# EAGLE design BacKey for MaKey MaKey (rev A) (EAGLE 6.4)

## Sheet 1 of 2
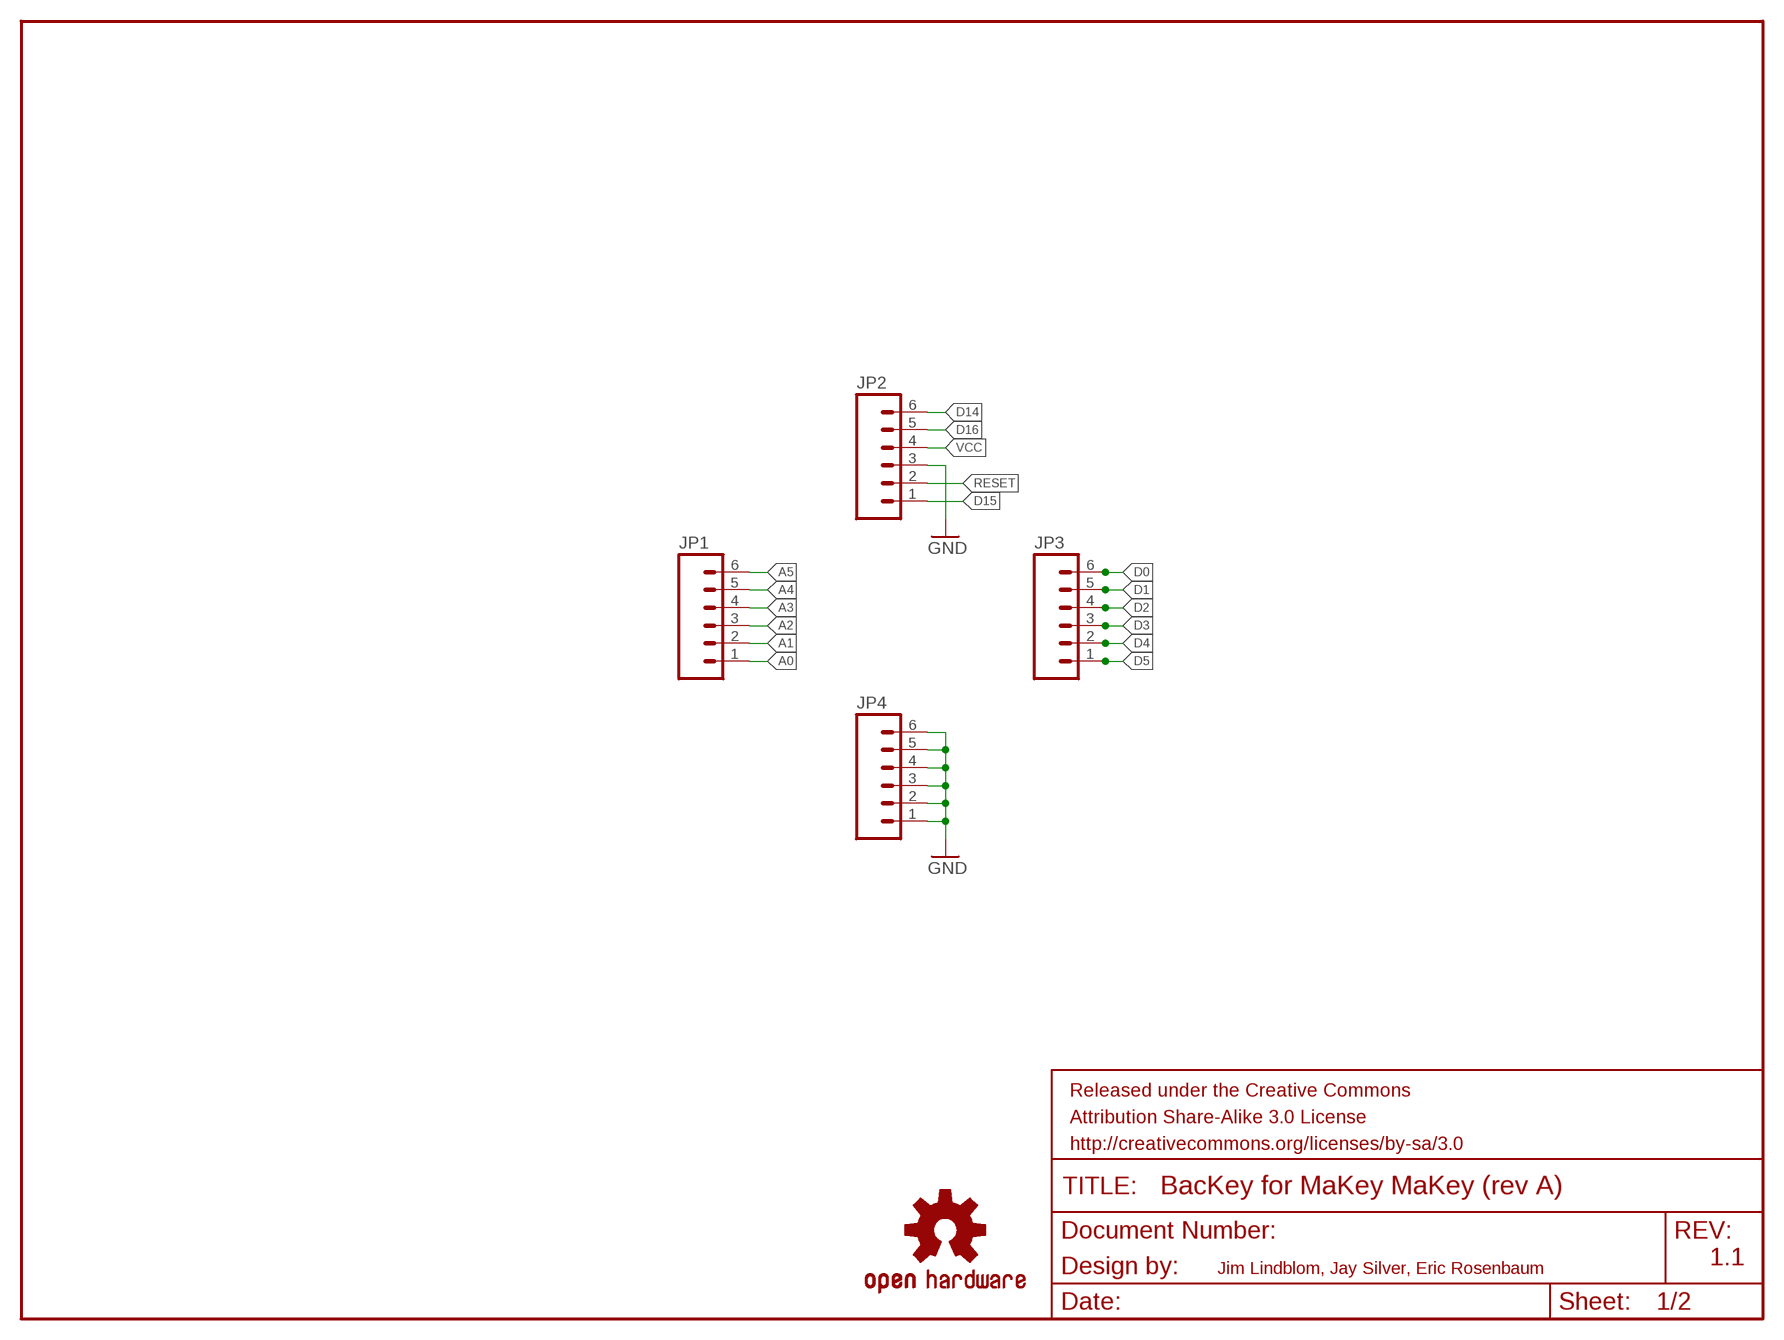
[diagram p0: schematic, sheet 1]

### Parts
JP1  M06SIP  [1X06]
JP2  M06SIP  [1X06]
JP3  M06SIP  [1X06]
JP4  M06SIP  [1X06]
U$1  OSHW-LOGOM  [OSHW-LOGO-M]

### Nets
A0: JP1.1
A1: JP1.2
A2: JP1.3
A3: JP1.4
A4: JP1.5
A5: JP1.6
D0: JP3.6
D1: JP3.5
D2: JP3.4
D3: JP3.3
D4: JP3.2
D5: JP3.1
D14: JP2.6
D15: JP2.1
D16: JP2.5
GND [vcc]: JP2.3 JP4.1 JP4.2 JP4.3 JP4.4 JP4.5 JP4.6
RESET: JP2.2
VCC: JP2.4

### Notes on the sheet
- 1.1
- Jim Lindblom, Jay Silver, Eric Rosenbaum

## Sheet 2 of 2
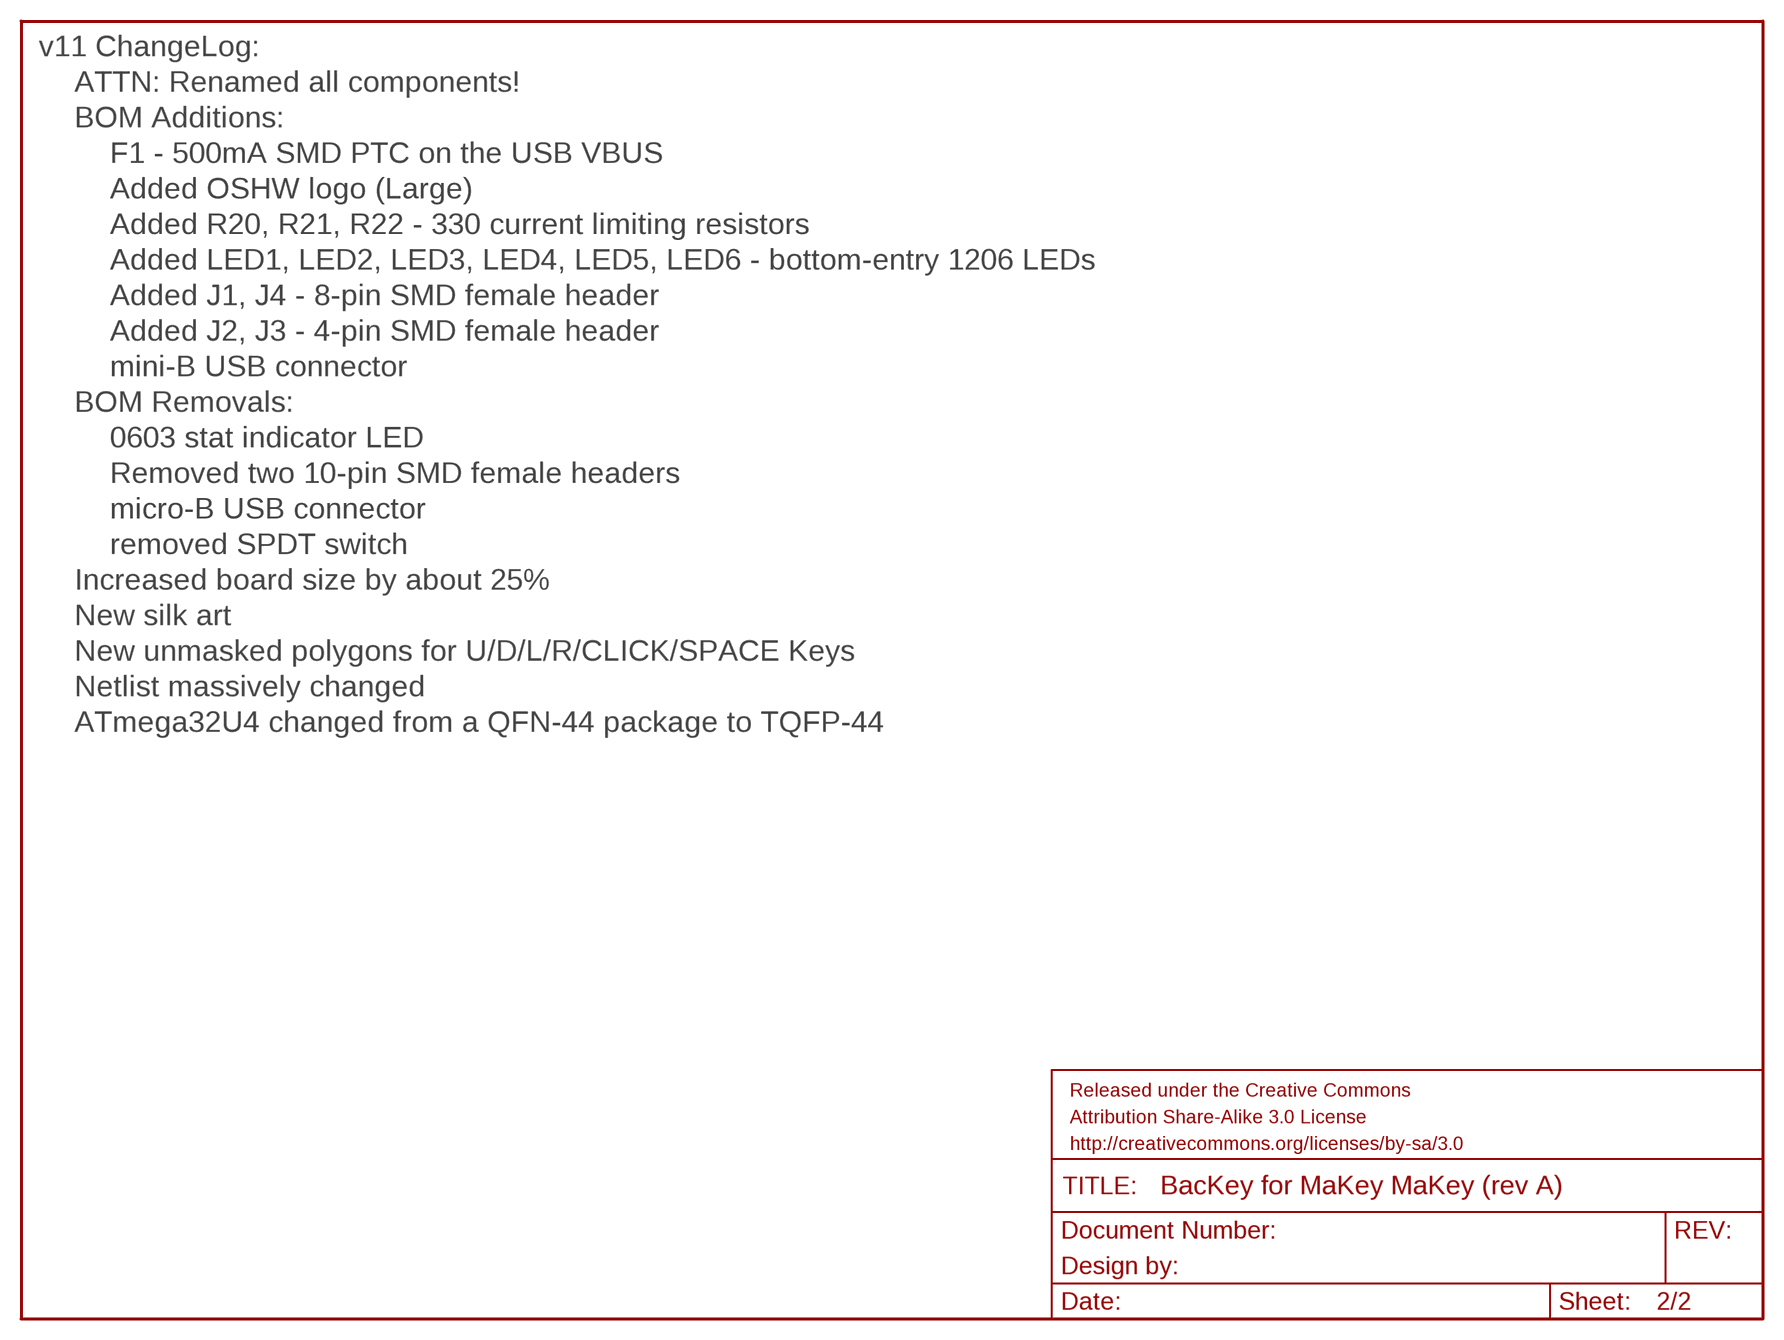
[diagram p1: schematic, sheet 2]

### Notes on the sheet
- v11 ChangeLog:
- ATTN: Renamed all components!
- BOM Additions:
- F1 - 500mA SMD PTC on the USB VBUS
- Added OSHW logo (Large)
- Added R20, R21, R22 - 330 current limiting resistors
- Added LED1, LED2, LED3, LED4, LED5, LED6 - bottom-entry 1206 LEDs
- Added J1, J4 - 8-pin SMD female header
- Added J2, J3 - 4-pin SMD female header
- mini-B USB connector
- BOM Removals:
- 0603 stat indicator LED
- Removed two 10-pin SMD female headers
- micro-B USB connector
- removed SPDT switch
- Increased board size by about 25%
- New silk art
- New unmasked polygons for U/D/L/R/CLICK/SPACE Keys
- Netlist massively changed
- ATmega32U4 changed from a QFN-44 package to TQFP-44

## Library data of the parts
JP1-JP4 = SparkFun-Connectors:M06: Header 6 Standard 6-pin 0.1" header. Use with straight break away headers (SKU : PRT-00116), right angle break away headers (PRT-00553), swiss pins (PRT-00743), machine pins (PRT-00117), and female headers (PRT-00115). Molex polarized connector foot print use with SKU : PRT-08094 with associated crimp pins and housings. NOTES ON THE VARIANTS LOCK and LOCK_LONGPADS... This footprint was designed to help hold the alignment of a through-hole component (i.e. 6-pin header) while soldering it into place. You may notice that each hole has been shifted either up or down by 0.005 of an inch from it's more standard position (which is a perfectly straight line). This slight alteration caused the pins (the squares in the middle) to touch the edges of the holes. Because they are alternating, it causes a "brace" to hold the component in place. 0.005 has proven to be the perfect amount of "off-center" position when using our standard breakaway headers. Although looks a little odd when you look at the bare footprint, once you have a header in there, the alteration is very hard to notice. Also,if you push a header all the way into place, it is covered up entirely on the bottom side. This idea of altering the position of holes to aid alignment will be further integrated into the Sparkfun Library for other footprints. It can help hold any component with 3 or more connection pins.
U$1 = SparkFun-Aesthetics:OSHW-LOGO: Open Source Hardware Logo This logo indicates the piece of hardware it is found on incorporates a OSHW license and/or adheres to the definition of open source hardware found here: http://freedomdefined.org/OSHW

## Net classes
0 default: width 0.203 mm

## Board
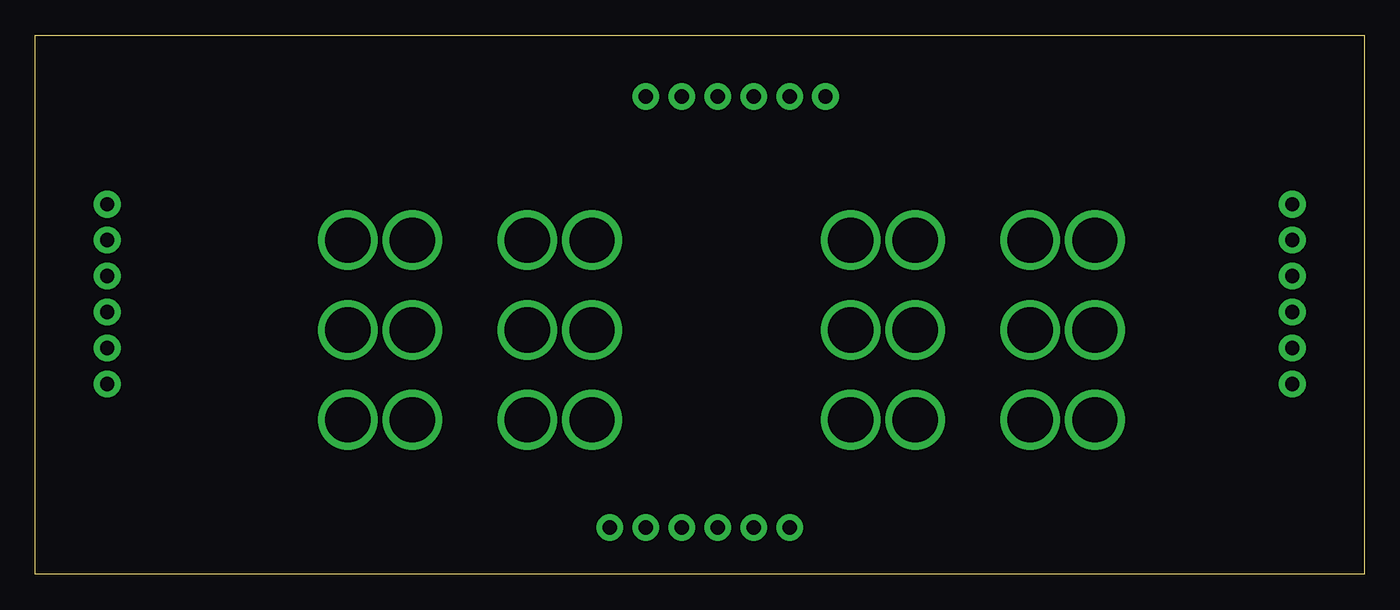
[diagram p2: board, top side]
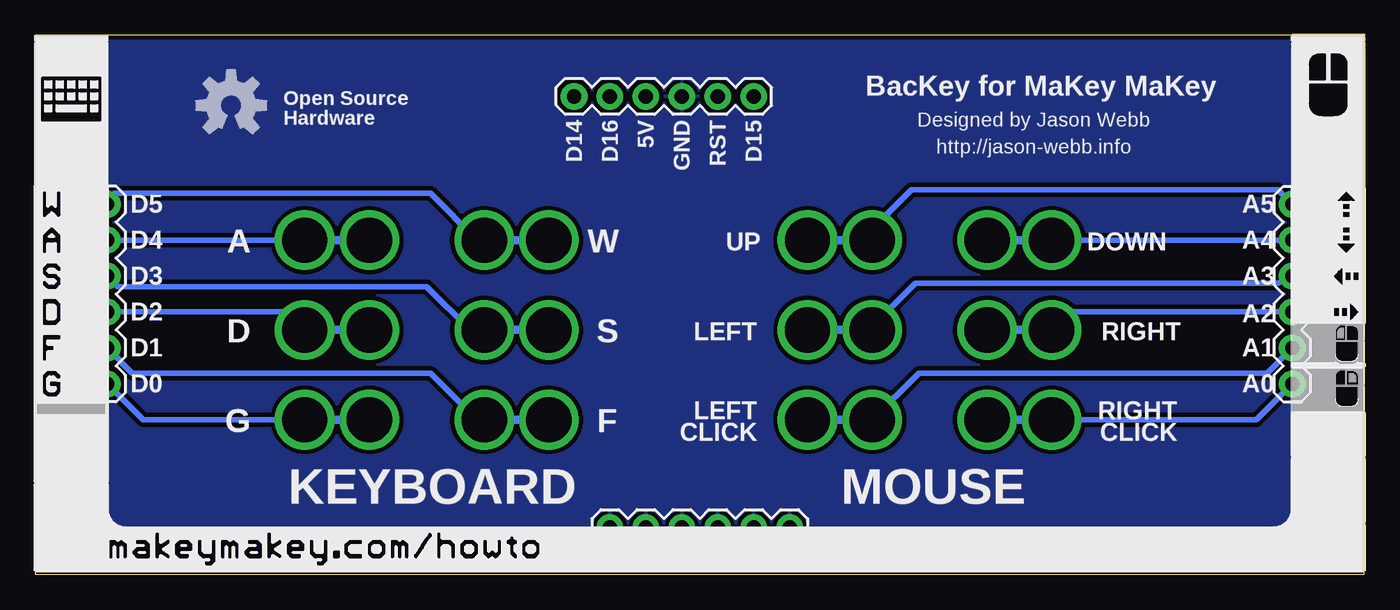
[diagram p3: board, bottom side, seen from below]

Size 93.98 x 38.1 mm. Coordinates in mm from the lower left corner, seen from the top.
Outline: 0,0 0,38.1 93.98,38.1 93.98,0 0,0
Copper layers (1*2*15*16): Top 0.035mm / dielectric 0.2mm / Route2 0.0175mm / dielectric 1.1mm / Route15 0.0175mm / dielectric 0.2mm / Bottom 0.035mm
Design rules "SeeedStudio_DRU_no_angle_20130527": minimum track width 6mil, minimum drill 12mil, track to track 6mil, track to pad 6mil, pad to pad 6mil, via to via 6mil, smd to smd 0mil, copper to edge 10mil, drill to drill 10mil, minimum pad ring 6mil, minimum via ring 6mil, stop-mask expansion 2mil, vias tented up to drill 25mil, thermal gap 10mil

### Footprints (pad centres in the part's own frame; a part is rotated, then mirrored left to right if it is on the bottom)
1X06 = drill 1.016 pad 1.88: 1 0,0; 2 2.54,0; 3 5.08,0; 4 7.62,0; 5 10.16,0; 6 12.7,0

### Placement (x,y rotation side)
JP1  5.08,13.46 90 bottom
JP2  43.18,33.78 180 bottom
JP3  88.9,26.16 270 bottom
JP4  53.34,3.3 0 bottom
U$1  80.14,33.15 0 bottom

### Tracks (layer width: path | path; a pad name or v marks a point on that pad's centre or on a via)
A0  (via drill 3.2)
  Bottom 0.406: JP1.1 7.62,10.92 v22.1,10.92
  Bottom 0.61: v26.67,10.92 v22.1,10.92
A1  (via drill 3.2)
  Bottom 0.406: JP1.2 6.86,14.22 31.5,14.22 v34.8,10.92
  Bottom 0.61: v39.37,10.92 v34.8,10.92
A2  (via drill 3.2)
  Bottom 0.406: JP1.3 20.83,18.54 v22.1,17.27
  Bottom 0.61: v26.67,17.27 v22.1,17.27
A3  (via drill 3.2)
  Bottom 0.406: JP1.4 6.1,20.57 31.75,20.57 35.05,17.27 35.31,17.27
  Bottom 0.61: 34.8,17.53 v34.8,17.27 35.31,17.27 v39.37,17.27
A4  (via drill 3.2)
  Bottom 0.406: JP1.5 v22.1,23.62
  Bottom 0.61: v26.67,23.62 v22.1,23.62
A5  (via drill 3.2)
  Bottom 0.406: JP1.6 6.1,27.18 32,27.18 34.8,24.38 v34.8,23.62
  Bottom 0.61: v39.37,23.62 v34.8,23.62
D0  (via drill 3.2)
  Bottom 0.406: JP3.6 86.36,10.92 v74.93,10.92
  Bottom 0.61: v70.36,10.92 v74.93,10.92
D1  (via drill 3.2)
  Bottom 0.406: JP3.5 87.12,14.22 66.04,14.22 62.74,10.92
  Bottom 0.61: 62.74,10.92 v62.23,10.92 v57.66,10.92
D2  (via drill 3.2)
  Bottom 0.406: JP3.4 76.2,18.54 v74.93,17.27
  Bottom 0.61: v70.36,17.27 v74.93,17.27
D3  (via drill 3.2)
  Bottom 0.406: JP3.3 88.14,20.32 66.29,20.32 63.25,17.27
  Bottom 0.61: 63.25,17.27 v62.23,17.27 v57.66,17.27
D4  (via drill 3.2)
  Bottom 0.406: JP3.2 v74.93,23.62
  Bottom 0.61: v70.36,23.62 v74.93,23.62
D5  (via drill 3.2)
  Bottom 0.406: 62.74,23.62 66.04,26.92 88.39,26.92 88.9,26.42 JP3.1
  Bottom 0.61: 62.74,23.62 v62.23,23.62 v57.66,23.62
GND
  pour Bottom (isolate 0.305): 5.21,38.1 5.08,3.3 88.9,3.3 89.03,38.1

### Text on the board
bPlace: BacKey for MaKey MaKey | Open Source | Designed by Jason Webb | D15 | RST | GND | 5V | D16 | D14 | Hardware | http://jason-webb.info | A5 | D5 | A4 | D4 | DOWN | UP | W | A | A3 | D3 | D2 | A2 | RIGHT | LEFT | A1 | S | D | D1 | A0 | D0 | RIGHT | LEFT | F | G | CLICK | CLICK | MOUSE | KEYBOARD